# Altium schematic sheet Supply.SchDoc
size A4
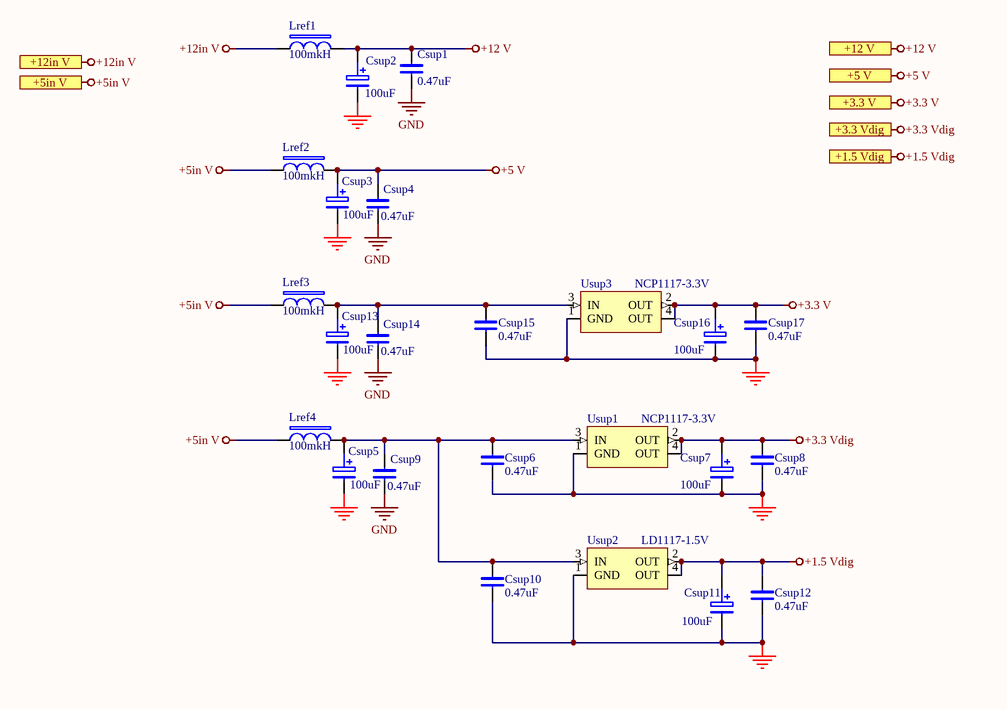
[diagram p0: Supply.SchDoc]

## Parts
Csup1  0.47uF  [chip0805]
Csup2  100uF  [CEL-SMD300]
Csup3  100uF  [CEL-SMD300]
Csup4  0.47uF  [chip0805]
Csup5  100uF  [CEL-SMD300]
Csup6  0.47uF  [chip0805]
Csup7  100uF  [CEL-SMD300]
Csup8  0.47uF  [chip0805]
Csup9  0.47uF  [chip0805]
Csup10  0.47uF  [chip0805]
Csup11  100uF  [CEL-SMD300]
Csup12  0.47uF  [chip0805]
Csup13  100uF  [CEL-SMD300]
Csup14  0.47uF  [chip0805]
Csup15  0.47uF  [chip0805]
Csup16  100uF  [CEL-SMD300]
Csup17  0.47uF  [chip0805]
Lref1  100mkH  [SDR0604]
Lref2  100mkH  [SDR0604]
Lref3  100mkH  [SDR0604]
Lref4  100mkH  [SDR0604]
Usup1  NCP1117-3.3V  [TO-252]
Usup2  LD1117-1.5V  [TO-252]
Usup3  NCP1117-3.3V  [TO-252]

## Ports
+1.5 Vdig (out), +3.3 V (out), +3.3 Vdig (out), +5 V (out), +5in V (in), +12 V (out), +12in V (in)

## Nets
+1.5 Vdig: Csup11.+ Csup12.1 Usup2.2(OUT) Usup2.4(OUT) ; port +1.5 Vdig
+3.3 V: Csup16.+ Csup17.1 Usup3.2(OUT) Usup3.4(OUT) ; port +3.3 V
+3.3 Vdig: Csup7.+ Csup8.1 Usup1.2(OUT) Usup1.4(OUT) ; port +3.3 Vdig
+5 V: Csup3.+ Csup4.1 Lref2.2 ; port +5 V
+5in V: Lref2.1 Lref3.1 Lref4.1 ; port +5in V
+12 V: Csup1.1 Csup2.+ Lref1.2 ; port +12 V
+12in V: Lref1.1 ; port +12in V
GND: Csup1.2 Csup2.- Csup3.- Csup4.2 Csup5.- Csup6.2 Csup7.- Csup8.2 Csup9.2 Csup10.2 Csup11.- Csup12.2 Csup13.- Csup14.2 Csup15.2 Csup16.- Csup17.2 Usup1.1(GND) Usup2.1(GND) Usup3.1(GND)
NetCsup5_+: Csup5.+ Csup6.1 Csup9.1 Csup10.1 Lref4.2 Usup1.3(IN) Usup2.3(IN)
NetCsup13_+: Csup13.+ Csup14.1 Csup15.1 Lref3.2 Usup3.3(IN)

## Library data of the parts
Csup1 Csup4 Csup6 Csup8-Csup10 Csup12 Csup14 Csup15 Csup17 = C: Text Field1: 20; Text Field2: 10
Csup2 Csup3 Csup5 Csup7 Csup11 Csup13 Csup16 = C POL: Text Field1: 20; Text Field2: 20
Lref1-Lref4 = DR: Text Field1: 30; Text Field2: 10
Usup2 = NCP1117-3.3V